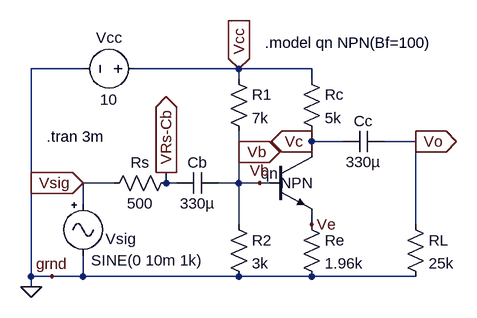
[diagram p0: schematic Q1b C.asc]
Q1b C.asc, the LTspice schematic file:
Version 4
SHEET 1 880 680
WIRE -192 128 -272 128
WIRE 48 128 -112 128
WIRE 160 128 48 128
WIRE 48 144 48 128
WIRE 160 144 160 128
WIRE 160 240 160 224
WIRE 208 240 160 240
WIRE 320 240 272 240
WIRE 48 256 48 224
WIRE 160 256 160 240
WIRE -144 304 -192 304
WIRE -64 304 -64 288
WIRE -48 304 -64 304
WIRE 48 304 48 256
WIRE 48 304 16 304
WIRE 80 304 48 304
WIRE 96 304 80 304
WIRE -192 336 -192 304
WIRE 48 368 48 304
WIRE 160 368 160 352
WIRE 320 368 320 240
WIRE -272 448 -272 128
WIRE -240 448 -272 448
WIRE -192 448 -192 416
WIRE -192 448 -240 448
WIRE 48 448 -192 448
WIRE 160 448 48 448
WIRE 320 448 160 448
WIRE -272 464 -272 448
FLAG -192 304 Vsig
IOPIN -192 304 In
FLAG -64 288 VRs-Cb
IOPIN -64 288 Out
FLAG 48 256 Vb
IOPIN 48 256 Out
FLAG 160 240 Vc
IOPIN 160 240 Out
FLAG 320 240 Vo
IOPIN 320 240 Out
FLAG 48 128 Vcc
IOPIN 48 128 In
FLAG -240 448 grnd
FLAG -272 464 0
FLAG 160 368 Ve
FLAG 80 304 Vb
SYMBOL voltage -96 128 R90
WINDOW 0 -32 56 VBottom 2
WINDOW 3 32 56 VTop 2
SYMATTR InstName Vcc
SYMATTR Value 10
SYMBOL res 144 128 R0
SYMATTR InstName Rc
SYMATTR Value 5k
SYMBOL res 32 128 R0
SYMATTR InstName R1
SYMATTR Value 7k
SYMBOL cap 272 224 R90
WINDOW 0 0 32 VBottom 2
WINDOW 3 32 32 VTop 2
SYMATTR InstName Cc
SYMATTR Value 330µ
SYMBOL cap 16 288 R90
WINDOW 0 0 32 VBottom 2
WINDOW 3 32 32 VTop 2
SYMATTR InstName Cb
SYMATTR Value 330µ
SYMBOL res -160 320 R270
WINDOW 0 32 56 VTop 2
WINDOW 3 0 56 VBottom 2
SYMATTR InstName Rs
SYMATTR Value 500
SYMBOL res 32 352 R0
SYMATTR InstName R2
SYMATTR Value 3k
SYMBOL res 144 352 R0
SYMATTR InstName Re
SYMATTR Value 1.96k
SYMBOL res 304 352 R0
SYMATTR InstName RL
SYMATTR Value 25k
SYMBOL npn 96 256 R0
WINDOW 0 -14 33 Left 2
WINDOW 3 16 48 Left 2
SYMATTR InstName qn
SYMBOL signal -192 320 R0
WINDOW 0 35 70 Left 2
WINDOW 3 12 103 Left 2
WINDOW 123 0 0 Left 2
WINDOW 39 0 0 Left 2
SYMATTR InstName Vsig
SYMATTR Value SINE(0 10m 1k)
TEXT 88 88 Left 2 !.model qn NPN(Bf=100)
TEXT -248 232 Left 2 !.tran 3m

The netlist it stands for:
* Q1b C.asc
Vcc Vcc 0 10
Rc Vcc Vc 5k
R1 Vcc Vb 7k
Cc Vo Vc 330µ
Cb Vb VRs-Cb 330µ
Rs Vsig VRs-Cb 500
R2 Vb 0 3k
Re Ve 0 1.96k
RL Vo 0 25k
qn Vc Vb Ve 0 NPN
Vsig Vsig 0 SINE(0 10m 1k)
.model NPN NPN
.model PNP PNP
.lib standard.bjt
.model qn NPN(Bf=100)
.tran 3m
.backanno
.end